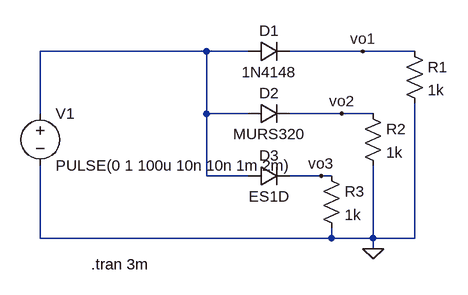
[diagram p0: schematic diode_comparison_tran.asc]
diode_comparison_tran.asc, the LTspice schematic file:
Version 4
SHEET 1 880 680
WIRE 32 -64 -224 -64
WIRE 96 -64 32 -64
WIRE 272 -64 160 -64
WIRE 352 -64 272 -64
WIRE -224 32 -224 -64
WIRE 32 32 32 -64
WIRE 96 32 32 32
WIRE 240 32 160 32
WIRE 288 32 240 32
WIRE 32 128 32 32
WIRE 96 128 32 128
WIRE 208 128 160 128
WIRE 224 128 208 128
WIRE -224 224 -224 112
WIRE 224 224 224 208
WIRE 224 224 -224 224
WIRE 288 224 288 112
WIRE 288 224 224 224
WIRE 352 224 352 16
WIRE 352 224 288 224
WIRE 288 240 288 224
FLAG 288 240 0
FLAG 272 -64 vo1
FLAG 240 32 vo2
FLAG 208 128 vo3
SYMBOL voltage -224 16 R0
WINDOW 123 0 0 Left 0
WINDOW 39 0 0 Left 0
SYMATTR InstName V1
SYMATTR Value PULSE(0 1 100u 10n 10n 1m 2m)
SYMBOL diode 96 -48 R270
WINDOW 0 32 32 VTop 2
WINDOW 3 0 32 VBottom 2
SYMATTR InstName D1
SYMATTR Value 1N4148
SYMBOL diode 96 48 R270
WINDOW 0 32 32 VTop 2
WINDOW 3 0 32 VBottom 2
SYMATTR InstName D2
SYMATTR Value MURS320
SYMBOL diode 96 144 R270
WINDOW 0 32 32 VTop 2
WINDOW 3 0 32 VBottom 2
SYMATTR InstName D3
SYMATTR Value ES1D
SYMBOL res 336 -80 R0
SYMATTR InstName R1
SYMATTR Value 1k
SYMBOL res 272 16 R0
SYMATTR InstName R2
SYMATTR Value 1k
SYMBOL res 208 112 R0
SYMATTR InstName R3
SYMATTR Value 1k
TEXT -146 264 Left 2 !.tran 3m

The netlist it stands for:
* diode_comparison_tran.asc
V1 N001 0 PULSE(0 1 100u 10n 10n 1m 2m)
D1 N001 vo1 1N4148
D2 N001 vo2 MURS320
D3 N001 vo3 ES1D
R1 vo1 0 1k
R2 vo2 0 1k
R3 vo3 0 1k
.model D D
.lib standard.dio
.tran 3m
.backanno
.end